# Altium schematic sheet 03_MCU.SchDoc
size A3; SheetNumber: 3; SheetTotal: 4
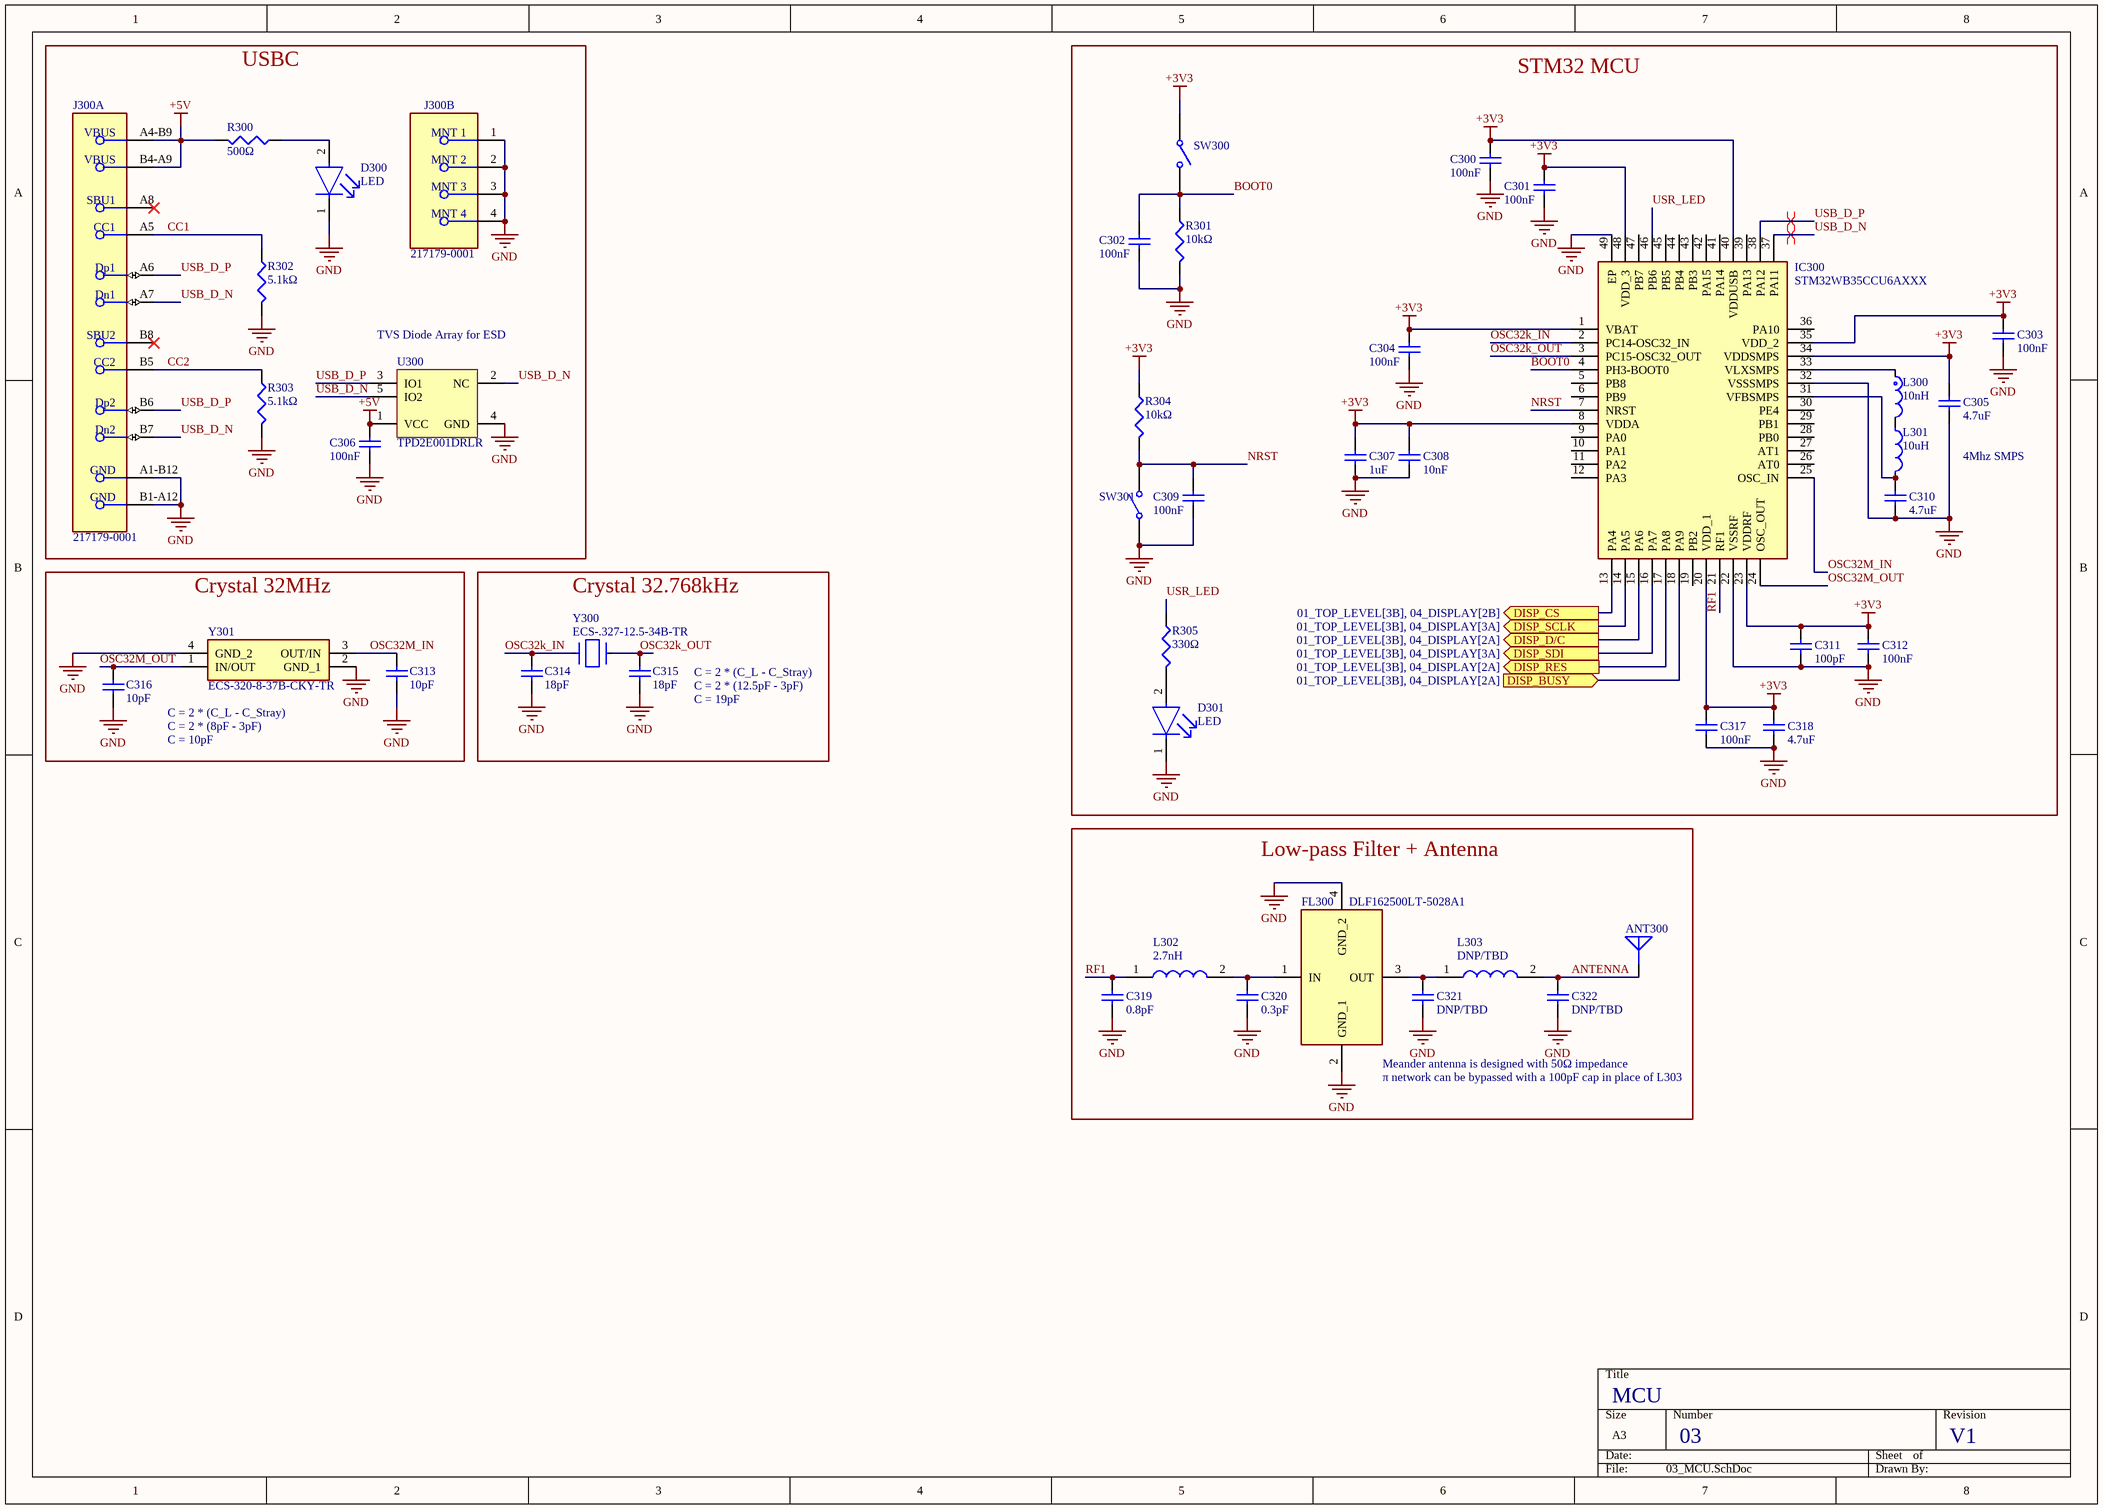
[diagram p0: 03_MCU.SchDoc]

## Parts
ANT300  MEANDER_ANTENNA  [MEANDER_ANTENNA]  (value not drawn)
C300  value 100nF  [CAPC1005X55X25LL05T10]  (hidden comment: Capacitor 1 uF +/- 10% 6.3 V 0402)
C301  value 100nF  [CAPC1005X55X25LL05T10]  (hidden comment: Capacitor 1 uF +/- 10% 6.3 V 0402)
C302  value 100nF  [CAPC1005X55X25LL05T10]  (hidden comment: Capacitor 1 uF +/- 10% 6.3 V 0402)
C303  value 100nF  [CAPC1005X55X25LL05T10]  (hidden comment: Capacitor 1 uF +/- 10% 6.3 V 0402)
C304  value 100nF  [CAPC1005X55X25LL05T10]  (hidden comment: Capacitor 1 uF +/- 10% 6.3 V 0402)
C305  value 4.7uF  [CAPC1005X55X25LL05T10]  (hidden comment: Capacitor 1 uF +/- 10% 6.3 V 0402)
C306  value 100nF  [CAPC1005X55X25LL05T10]  (hidden comment: Capacitor 1 uF +/- 10% 6.3 V 0402)
C307  value 1uF  [CAPC1005X55X25LL05T10]  (hidden comment: Capacitor 1 uF +/- 10% 6.3 V 0402)
C308  value 10nF  [CAPC1005X55X25LL05T10]  (hidden comment: Capacitor 1 uF +/- 10% 6.3 V 0402)
C309  value 100nF  [CAPC1005X55X25LL05T10]  (hidden comment: Capacitor 1 uF +/- 10% 6.3 V 0402)
C310  value 4.7uF  [CAPC1005X55X25LL05T10]  (hidden comment: Capacitor 1 uF +/- 10% 6.3 V 0402)
C311  value 100pF  [CAPC1005X55X25LL05T10]  (hidden comment: Capacitor 1 uF +/- 10% 6.3 V 0402)
C312  value 100nF  [CAPC1005X55X25LL05T10]  (hidden comment: Capacitor 1 uF +/- 10% 6.3 V 0402)
C313  value 10pF  [CAPC1005X55X25LL05T10]  (hidden comment: Capacitor 1 uF +/- 10% 6.3 V 0402)
C314  value 18pF  [CAPC1005X55X25LL05T10]  (hidden comment: Capacitor 1 uF +/- 10% 6.3 V 0402)
C315  value 18pF  [CAPC1005X55X25LL05T10]  (hidden comment: Capacitor 1 uF +/- 10% 6.3 V 0402)
C316  value 10pF  [CAPC1005X55X25LL05T10]  (hidden comment: Capacitor 1 uF +/- 10% 6.3 V 0402)
C317  value 100nF  [CAPC1005X55X25LL05T10]  (hidden comment: Capacitor 1 uF +/- 10% 6.3 V 0402)
C318  value 4.7uF  [CAPC1005X55X25LL05T10]  (hidden comment: Capacitor 1 uF +/- 10% 6.3 V 0402)
C319  value 0.8pF  [CAPC1005X55X25LL05T10]  (hidden comment: Capacitor 1 uF +/- 10% 6.3 V 0402)
C320  value 0.3pF  [CAPC1005X55X25LL05T10]  (hidden comment: Capacitor 1 uF +/- 10% 6.3 V 0402)
C321  value DNP/TBD  [CAPC1005X55X25LL05T10]  (hidden comment: Capacitor 1 uF +/- 10% 6.3 V 0402)
C322  value DNP/TBD  [CAPC1005X55X25LL05T10]  (hidden comment: Capacitor 1 uF +/- 10% 6.3 V 0402)
D300  LED  [FP-VLMO1500-GS08-MFG]
D301  LED  [FP-VLMO1500-GS08-MFG]
FL300  DLF162500LT-5028A1  [DLF162500LT5028A1]
IC300  STM32WB35CCU6AXXX  [QFN50P700X700X65-49N-D]
J300  217179-0001  [FP-2171790001-MFG]  (parts A,B of 2)
L300  10nH  [FP-LQG15WH_02-MFG]
L301  10uH  [FP-LQM21FN_70-MFG]
L302  2.7nH  [LQG15WH0N7B02D]
L303  DNP/TBD  [LQG15WH0N7B02D]
R300  value 500Ω  [RESC0402(1005)_L]  (hidden comment: 100R2F)
R301  value 10kΩ  [RESC0402(1005)_L]  (hidden comment: 100R2F)
R302  value 5.1kΩ  [RESC0402(1005)_L]  (hidden comment: 100R2F)
R303  value 5.1kΩ  [RESC0402(1005)_L]  (hidden comment: 100R2F)
R304  value 10kΩ  [RESC0402(1005)_L]  (hidden comment: 100R2F)
R305  value 330Ω  [RESC0402(1005)_L]  (hidden comment: 100R2F)
SW300  434111050826  [434111050826]  (value not drawn)
SW301  434111050826  [434111050826]  (value not drawn)
U300  TPD2E001DRLR  [DRL0005A_L]
Y300  ECS-.327-12.5-34B-TR  [FP-ECX-31B-MFG]
Y301  ECS-320-8-37B-CKY-TR  [ECS320837BCKYTR]

## Blocks framed on the sheet
USBC: C306 D300 J300 R300 R302 R303 U300
STM32 MCU: C300-C305 C307-C312 C317 C318 D301 IC300 L300 L301 R301 R304 R305 SW300 SW301
Crystal 32MHz: C313 C316 Y301
Crystal 32.768kHz: C314 C315 Y300
Low-pass Filter + Antenna: ANT300 C319-C322 FL300 L302 L303

## Ports
DISP_BUSY (in, see 01_TOP_LEVEL[3B], 04_DISPLAY[2A]), DISP_CS (out, see 01_TOP_LEVEL[3B], 04_DISPLAY[2B]), DISP_D/C (out, see 01_TOP_LEVEL[3B], 04_DISPLAY[2A]), DISP_RES (out, see 01_TOP_LEVEL[3B], 04_DISPLAY[2A]), DISP_SCLK (out, see 01_TOP_LEVEL[3B], 04_DISPLAY[3A]), DISP_SDI (out, see 01_TOP_LEVEL[3B], 04_DISPLAY[3A])

## Nets
+3V3: C300.2 C301.2 C303.2 C304.2 C305.2 C307.2 C308.2 C311.2 C312.2 C317.2 C318.2 IC300.1(VBAT) IC300.8(VDDA) IC300.20(VDD_1) IC300.23(VDDRF) IC300.34(VDDSMPS) IC300.35(VDD_2) IC300.40(VDDUSB) IC300.48(VDD_3) R304.1 SW300.1
+5V: C306.2 J300.A4-B9(VBUS) J300.B4-A9(VBUS) R300.2 U300.1(VCC)
GND: C300.1 C301.1 C302.1 C303.1 C304.1 C305.1 C306.1 C307.1 C308.1 C309.1 C310.1 C311.1 C312.1 C313.1 C314.1 C315.1 C316.1 C317.1 C318.1 C319.1 C320.1 C321.1 C322.1 D300.1(C) D301.1(C) FL300.2(GND_1) FL300.4(GND_2) IC300.22(VSSRF) IC300.32(VSSSMPS) IC300.49(EP) J300.1(MNT_1) J300.2(MNT_2) J300.3(MNT_3) J300.4(MNT_4) J300.A1-B12(GND) J300.B1-A12(GND) R301.2 R302.2 R303.2 SW301.1 U300.4(GND) Y301.2(GND_1) Y301.4(GND_2)
ANTENNA: ANT300.0 C322.2 L303.2
BOOT0: C302.2 IC300.4(PH3-BOOT0) R301.1 SW300.2
CC1: J300.A5(CC1) R302.1
CC2: J300.B5(CC2) R303.1
DISP_BUSY: IC300.18(PA9) ; port DISP_BUSY
DISP_CS: IC300.13(PA4) ; port DISP_CS
DISP_D/C: IC300.15(PA6) ; port DISP_D/C
DISP_RES: IC300.17(PA8) ; port DISP_RES
DISP_SCLK: IC300.14(PA5) ; port DISP_SCLK
DISP_SDI: IC300.16(PA7) ; port DISP_SDI
NRST: C309.2 IC300.7(NRST) R304.2 SW301.2
OSC32k_IN: C314.2 IC300.2(PC14-OSC32_IN) Y300.1(In/Out)
OSC32k_OUT: C315.2 IC300.3(PC15-OSC32_OUT) Y300.2(Out/In)
OSC32M_IN: C313.2 IC300.25(OSC_IN) Y301.3(OUT/IN)
OSC32M_OUT: C316.2 IC300.24(OSC_OUT) Y301.1(IN/OUT)
RF1: C319.2 IC300.21(RF1) L302.1
USB_D_N: IC300.37(PA11) J300.A7(Dn1) J300.B7(Dn2) U300.2(NC) U300.5(IO2)
USB_D_P: IC300.38(PA12) J300.A6(Dp1) J300.B6(Dp2) U300.3(IO1)
USR_LED: IC300.46(PB6) R305.1
NetC310_2: C310.2 IC300.31(VFBSMPS) L301.2
NetC320_2: C320.2 FL300.1(IN) L302.2
NetC321_2: C321.2 FL300.3(OUT) L303.1
NetD300_2: D300.2(A) R300.1
NetD301_2: D301.2(A) R305.2
NetIC300_33: IC300.33(VLXSMPS) L300.1
NetL300_2: L300.2 L301.1

Not connected (* = marked no-connect by the designer): IC300 5(PB8) 6(PB9) 9(PA0) 10(PA1) 11(PA2) 12(PA3) 19(PB2) 26(AT0) 27(AT1) 28(PB0) 29(PB1) 30(PE4) 36(PA10) 39(PA13) 41(PA14) 42(PA15) 43(PB3) 44(PB4) 45(PB5) 47(PB7); J300 A8(SBU1)* B8(SBU2)*

## Layout directives
differential pair: USB_D_N, USB_D_P

## Notes on the sheet
- (near U300) TVS Diode Array for ESD
- 4Mhz SMPS
- C = 2 * (C_L - C_Stray)
- C = 2 * (12.5pF - 3pF)
- C = 19pF
- C = 2 * (8pF - 3pF)
- C = 10pF
- (near FL300) Meander antenna is designed with 50Ω impedance
- (near FL300) π network can be bypassed with a 100pF cap in place of L303
- MCU
- 03
- V1

## Library data of the parts
ANT300 = MEANDER_ANTENNA: 2.4GHz meander antenna; ComponentLink1Description: ST Guidelines; ComponentLink1URL: https://www.st.com/resource/en/application_note/an5129-guidelines-for-meander-design-using-lowcost-pcb-antennae-with-24-ghz-radio-for-stm32wbwb0-mcus-stmicroelectronics.pdf
C300-C322 = CMP-001-00008-6: Chip Capacitor, 1 uF, +/- 10%, 6.3 V, 0402 (1005 Metric); Capacitor Type: Ceramic; Voltage Rating: 6.3V; Max Operating Temperature: 85°C; Mounting Technology: SM; Tolerance: 10%; Case/Package: 0402; RoHS Compliant: True; Min Operating Temperature: -55°C; Pins: 2
D300 D301 = CMP-00030-24098164-1: VLMO1500-GS08 LED Uni-Color Soft Orange 611nm 2-Pin Chip 0402(1006Metric) T/R; Luminous Intensity: 90mcd; Dominant Wavelength: 605nm; Forward Voltage: 2V; Test Current: 20mA; Lens Style: Rectangular, Square; Reverse Voltage: 5V; Power Rating: 75mW; Viewing Angle: 130°; Number of LEDs: 1; NexarPartId: 24098164; Ambient Temperature Range High: 85°C; Wavelength: 605nm; Schedule B: 8541402000, 8541402000; Number of Pins: 2; Length: 1mm; Width: 500µm; Illumination Color: Orange; Case/Package: 0402; RoHS: Compliant; Packaging: Cut Tape; Radiation Hardening: No; Case Code (Imperial): 0402; Lead Free: Lead Free; Case Code (Metric): 1005; Forward Current: 20mA; Color: Orange; Min Operating Temperature: -30°C; Height: 350µm; Max Operating Temperature: 85°C; Mount: Surface Mount; Power Dissipation: 75mW
FL300 = DLF162500LT-5028A1: Filter; Manufacturer_Name: TDK; Datasheet Link: https://product.tdk.com/system/files/dam/doc/product/rf/rf/filter/catalog/rf_lpf_dlf162500lt-5028a1_en.pdf; Height: 0.4mm; Manufacturer_Part_Number: DLF162500LT-5028A1; Mouser Part Number: 810-DLF16250LT5028A1; Mouser Price/Stock: https://www.mouser.co.uk/ProductDetail/TDK/DLF162500LT-5028A1?qs=U%2FZX79kHR%2FlwIbAISCs3qA%3D%3D; Arrow Part Number: DLF162500LT-5028A1; Arrow Price/Stock: https://www.arrow.com/en/products/dlf162500lt-5028a1/tdk?utm_currency=USD&region=nac
IC300 = STM32WB35CCU6AXXX: Integrated Circuit; Manufacturer_Name: STMicroelectronics; Datasheet Link: https://www.st.com/resource/en/datasheet/stm32wb35cc.pdf; Height: 0.65mm; Manufacturer_Part_Number: STM32WB35CCU6AXXX; ComponentLink1Description: DigiKey; ComponentLink1URL: https://www.digikey.ca/en/products/detail/stmicroelectronics/STM32WB35CCU6A/13282469
J300 = CMP-04767-000028-2: CONN RCP USB2.0 TYP C 24P SMD RA; NexarPartId: 117190526; Gender: Receptacle; Number of Contacts: 16; Current Rating: 1.25A; Voltage Rating: 30V; Min Operating Temperature: -40°C; USB Standard: USB 2.0; Height: 3.36mm; Contact Material: Gold, Nickel; Max Operating Temperature: 85°C
L300 = CMP-06042-005237-1: Multilayer type Inductor for Automotive 10nH ±5% 0.19Ω 500mA 0402; Core Material: Air; Test Frequency: 100MHz; DC Resistance (DCR): 190mR; Shielding: Unshielded; Self Resonant Frequency: 3.3GHz; Min Operating Temperature: -55°C; Tolerance: 5%; Inductance: 10nH; Max Operating Temperature: 125°C; Packaging: Cut Tape; Current Rating: 500mA; Case Code (Metric): 1005; Mount: Surface Mount; Case/Package: 0402; Ratings: AEC-Q200; Case Code (Imperial): 0402
L301 = CMP-2000-06587-2: FIXED IND 10UH 100MA 780MOHM SMD; Shielding: Shielded; Core Material: Ferrite; Self Resonant Frequency: 15MHz; Tolerance: 20%; DC Resistance (DCR): 780mR; Test Frequency: 1MHz; Height: 1.45mm; Package Quantity: 3000; Width: 0.049inch; Inductance: 10uH; Saturation Current: 100mA; Termination: SMD/SMT; Case Code (Metric): 2012; Case/Package: 0805; RoHS Compliant: Yes; Series: LQM21F_70; Max Operating Temperature: 125°C; Lead Free: Lead Free; DC Current: 100mA; Length: 2.2mm; Radiation Hardening: No; Max DC Current: 100mA; Case Code (Imperial): 0805; Packaging: Tape and Reel; Height - Seated (Max): 0.057inch; Rated Current-Max: 100mA; Military Standard: Not; Mount: Surface Mount; Min Operating Temperature: -55°C; Depth: 1.45mm; Current Rating: 100mA
L302 L303 = LQG15HS2N7S02D: Inductor; Manufacturer_Name: Murata Electronics; Datasheet Link: https://search.murata.co.jp/Ceramy/image/img/P02/JELF243B-0010.pdf; Height: 0.6mm; Manufacturer_Part_Number: LQG15HS2N7S02D; Mouser Part Number: 81-LQG15HS2N7S02D; Mouser Price/Stock: https://www.mouser.co.uk/ProductDetail/Murata-Electronics/LQG15HS2N7S02D?qs=ctz47l0uL1AKrLI74yO5Qw%3D%3D; Arrow Part Number: LQG15HS2N7S02D; Arrow Price/Stock: https://www.arrow.com/en/products/lqg15hs2n7s02d/murata-manufacturing?utm_currency=USD&region=nac
R300-R305 = CMP-009-00065-2: 100R 0.063W 1% 0402 (1005 Metric)  SMD; Power: 63mW; Tolerance: 1%; Case/Package: 0402; Pins: 2; Mounting Technology: SMT
SW300 SW301 = CMP-1459-00003-6: Switch Tactile Spst-no 0.05A 12V; Manufacturer Lifecycle Status: ACTIVE; Actuator Length: 1.5mm; Current Rating: 50mA; Switch Travel: 250µm; Actuator Material: Liquid Crystal Polymer, Polymer; Contact Resistance: 100mΩ; Mechanical Life: 30kcycles; Operating Force: 260N; Illumination Type: Illuminated, Non-Illuminated; Switch Function: Off-Mom; YEOL: 1 = Estimated lifetime > 10 years; Throw Configuration: SPST; Termination: SMD/SMT; Contact Material: Stainless Steel, Steel; Min Operating Temperature: -40°C; Lifecycle Status: Production; Contact Plating: Silver; Contact Current Rating: 50mA; Packaging: Tape and Reel; Length: 8mm; RoHS: Compliant; REACH SVHC: No; Max Operating Temperature: 85°C; Height: 5mm; Insulation Resistance: 100MΩ; Voltage Rating: 12V; Mount: Surface Mount
U300 = CMP-0326-00048-3: Low-Capacitance + / - 15 kV ESD-Protection Array for High-Speed Data Interfaces, 2 Channels, -40 to +85 degC, 5-pin SOT (DRL), Green (RoHS & no Sb/Br); Manufacturer: Texas Instruments; IO Leakage Current(nA): 1; IEC 61000-4-2 Air-Gap(+/- kV): 15; IEC 61000-4-2 Contact(+/- kV): 8; SubFamily: ESD Solution; IO Capacitance(Typ)(pF): 1.5; Breakdown Voltage(Min)(V): 11; USB High Speed: TRUE; ComponentLink3Description: URL Link1; PackageReference: DRL0005A; PartNumber: TPD2E001DRLR; PackageDescription: 5-Pin Plastic Small Outline, Flat Lead 0.5 mm Pitch; PackageVersion: revD, Aug-2007; DatasheetVersion: SLLS684F; ComponentLink1Description: Manufacturer URL; ComponentLink2Description: Datasheet; ComponentLink1URL: http://www.ti.com/; ComponentLink2URL: http://www.ti.com/general/docs/lit/getliterature.tsp?genericPartNumber=TPD2E001&fileType=pdf; ComponentLink3URL: SamplesURL:http://www.ti.com/product/tpd2e001#samples; Eco-Plan: Green (RoHS & no Sb/Br); Mounting Technology: Surface Mount
Y300 = CMP-40224-000020-1: CRYSTAL 32.7680KHZ 12.5PF SMD; Frequency Tolerance: 20ppm; Frequency: 32.768kHz; ESR (Equivalent Series Resistance): 70kR; Max Operating Temperature: 85°C; Height: 0.035inch; Number of Pins: 2; Width: 0.059inch; Package Quantity: 3000; Length: 0.126inch; Min Operating Temperature: -40°C; Load Capacitance: 12.5pF; Mount: Surface Mount; Case/Package: SMD/SMT; Termination: SMD/SMT; Packaging: Tape and Reel
Y301 = ECS-320-8-37B-CKY-TR: Crystal or Oscillator; Manufacturer_Name: ECS; Datasheet Link: https://ecsxtal.com/store/pdf/ECX-1637B.pdf; Height: 0.5mm; Manufacturer_Part_Number: ECS-320-8-37B-CKY-TR; Mouser Part Number: 520-320-8-37B-CKYT; Mouser Price/Stock: https://www.mouser.co.uk/ProductDetail/ECS/ECS-320-8-37B-CKY-TR?qs=l7cgNqFNU1jF5E15eCxZkA%3D%3D; Arrow Part Number: ECS-320-8-37B-CKY-TR; Arrow Price/Stock: https://www.arrow.com/en/products/ecs-320-8-37b-cky-tr/ecs-international?region=nac